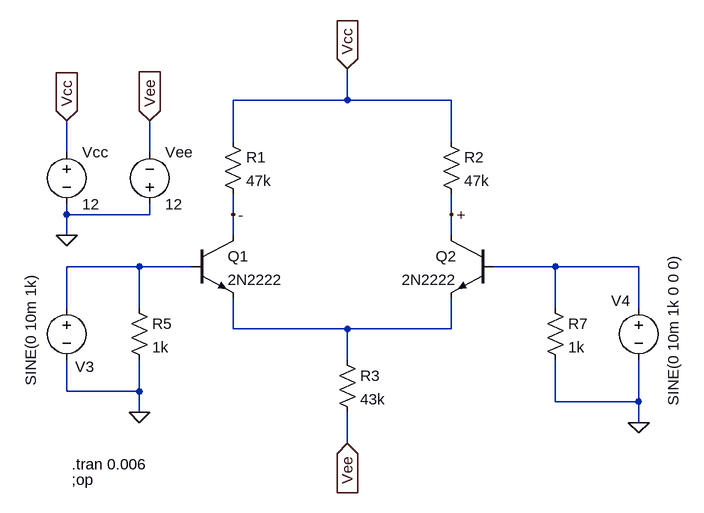
[diagram p0: schematic task.asc]
task.asc, the LTspice schematic file:
Version 4
SHEET 1 880 1000
WIRE 128 16 128 -32
WIRE 128 16 -48 16
WIRE 288 16 128 16
WIRE -48 80 -48 16
WIRE 288 80 288 16
WIRE -304 96 -304 48
WIRE -176 96 -176 48
WIRE -304 192 -304 176
WIRE -176 192 -176 176
WIRE -176 192 -304 192
WIRE -48 192 -48 160
WIRE 288 192 288 160
WIRE -304 224 -304 192
WIRE -48 224 -48 192
WIRE 288 224 288 192
WIRE -192 272 -304 272
WIRE -112 272 -192 272
WIRE 448 272 352 272
WIRE 576 272 448 272
WIRE -304 336 -304 272
WIRE -192 336 -192 272
WIRE 448 336 448 272
WIRE 576 336 576 272
WIRE -48 368 -48 320
WIRE 128 368 -48 368
WIRE 288 368 288 320
WIRE 288 368 128 368
WIRE 128 416 128 368
WIRE -304 464 -304 416
WIRE -192 464 -192 416
WIRE -192 464 -304 464
WIRE 448 480 448 416
WIRE 576 480 576 416
WIRE 576 480 448 480
WIRE -192 496 -192 464
WIRE 576 512 576 480
WIRE 128 544 128 496
FLAG -192 496 0
FLAG 576 512 0
FLAG 128 -32 Vcc
IOPIN 128 -32 In
FLAG 128 544 Vee
IOPIN 128 544 In
FLAG -304 48 Vcc
IOPIN -304 48 In
FLAG -176 48 Vee
IOPIN -176 48 In
FLAG -304 224 0
FLAG 288 192 +
FLAG -48 192 -
SYMBOL res -64 64 R0
SYMATTR InstName R1
SYMATTR Value 47k
SYMBOL res 272 64 R0
SYMATTR InstName R2
SYMATTR Value 47k
SYMBOL npn -112 224 R0
SYMATTR InstName Q1
SYMATTR Value 2N2222
SYMBOL npn 352 224 M0
SYMATTR InstName Q2
SYMATTR Value 2N2222
SYMBOL res -208 320 R0
SYMATTR InstName R5
SYMATTR Value 1k
SYMBOL voltage -304 320 R0
WINDOW 0 13 106 Left 2
WINDOW 3 -55 -36 VRight 2
WINDOW 123 -54 16 VRight 2
WINDOW 39 0 0 Left 0
SYMATTR InstName V3
SYMATTR Value SINE(0 10m 1k)
SYMBOL res 432 320 R0
SYMATTR InstName R7
SYMATTR Value 1k
SYMBOL voltage 576 320 R0
WINDOW 123 58 11 VRight 2
WINDOW 39 0 0 Left 0
WINDOW 0 -42 5 Left 2
WINDOW 3 53 -66 VRight 2
SYMATTR InstName V4
SYMATTR Value SINE(0 10m 1k 0 0 0)
SYMBOL res 112 400 R0
SYMATTR InstName R3
SYMATTR Value 43k
SYMBOL voltage -304 80 R0
SYMATTR InstName Vcc
SYMATTR Value 12
SYMBOL voltage -176 192 M180
WINDOW 0 24 96 Left 2
WINDOW 3 24 16 Left 2
SYMATTR InstName Vee
SYMATTR Value 12
TEXT -296 600 Left 2 !;op
TEXT -296 576 Left 2 !.tran 0.006

The netlist it stands for:
* task.asc
R1 Vcc - 47k
R2 Vcc + 47k
Q1 - N001 N003 0 2N2222
Q2 + N002 N003 0 2N2222
R5 N001 0 1k
V3 N001 0 SINE(0 10m 1k)
R7 N002 0 1k
V4 N002 0 SINE(0 10m 1k 0 0 0)
R3 N003 Vee 43k
Vcc Vcc 0 12
Vee 0 Vee 12
.model NPN NPN
.model PNP PNP
.lib standard.bjt
;op
.tran 0.006
.backanno
.end

* Results of the author's LTspice run, read from the files saved beside the schematic
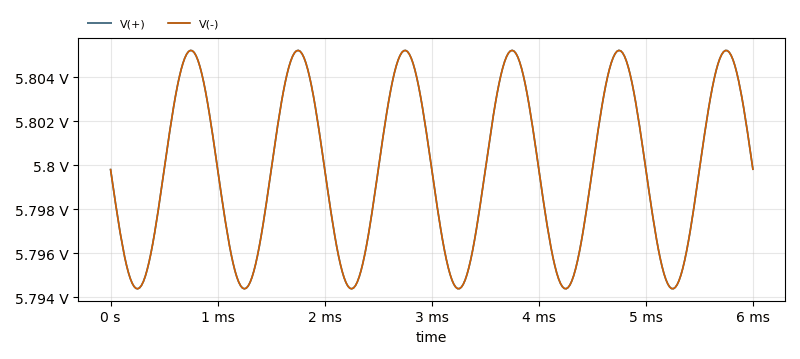
[diagram p1: Transient Analysis of task.asc, plotted from the saved traces]
* Transient Analysis, 1 run:
*   V(+): min 5.794 V, max 5.805 V, average 5.8 V, rms 5.8 V, last 5.8 V
*   V(-): min 5.794 V, max 5.805 V, average 5.8 V, rms 5.8 V, last 5.8 V